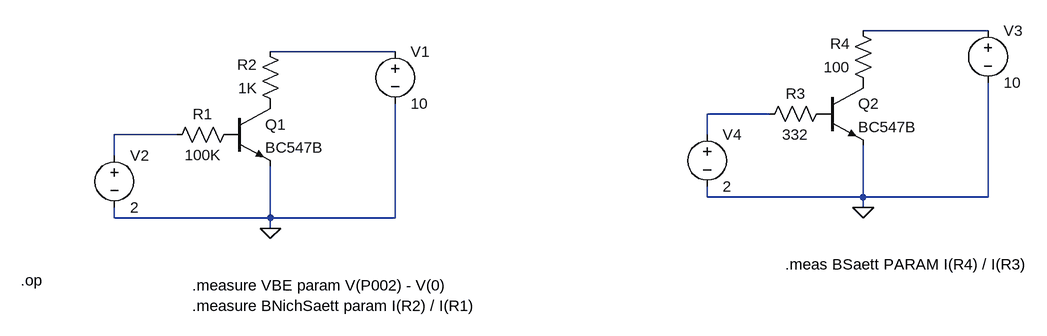
[diagram p0: schematic Schaltverstärker_Transistor_Simulation.asc]
Schaltverstärker_Transistor_Simulation.asc, the LTspice schematic file:
Version 4
SHEET 1 1420 680
WIRE 1248 -144 1056 -144
WIRE 336 -112 144 -112
WIRE 912 -16 816 -16
WIRE 0 16 -96 16
WIRE 816 16 816 -16
WIRE -96 48 -96 16
WIRE 816 112 816 96
WIRE 1056 112 1056 32
WIRE 1056 112 816 112
WIRE 1248 112 1248 -64
WIRE 1248 112 1056 112
WIRE 1056 128 1056 112
WIRE -96 144 -96 128
WIRE 144 144 144 64
WIRE 144 144 -96 144
WIRE 336 144 336 -32
WIRE 336 144 144 144
WIRE 144 160 144 144
FLAG 144 160 0
FLAG 1056 128 0
SYMBOL npn 80 -32 R0
SYMATTR InstName Q1
SYMATTR Value BC547B
SYMBOL res 96 0 R90
WINDOW 0 0 56 VBottom 2
WINDOW 3 32 56 VTop 2
SYMATTR InstName R1
SYMATTR Value 100K
SYMATTR SpiceLine tol=1 pwr=0.1
SYMBOL voltage 336 -128 R0
WINDOW 123 0 0 Left 0
WINDOW 39 0 0 Left 0
SYMATTR InstName V1
SYMATTR Value 10
SYMBOL res 160 -16 R180
WINDOW 0 36 76 Left 2
WINDOW 3 36 40 Left 2
SYMATTR InstName R2
SYMATTR Value 1K
SYMATTR SpiceLine tol=1 pwr=0.1
SYMBOL voltage -96 32 R0
WINDOW 123 0 0 Left 0
WINDOW 39 0 0 Left 0
SYMATTR InstName V2
SYMATTR Value 2
SYMBOL npn 992 -64 R0
SYMATTR InstName Q2
SYMATTR Value BC547B
SYMBOL res 1008 -32 R90
WINDOW 0 0 56 VBottom 2
WINDOW 3 32 56 VTop 2
SYMATTR InstName R3
SYMATTR Value 332
SYMATTR SpiceLine tol=1 pwr=0.1
SYMBOL voltage 1248 -160 R0
WINDOW 123 0 0 Left 0
WINDOW 39 0 0 Left 0
SYMATTR InstName V3
SYMATTR Value 10
SYMBOL res 1072 -48 R180
WINDOW 0 36 76 Left 2
WINDOW 3 36 40 Left 2
SYMATTR InstName R4
SYMATTR Value 100
SYMATTR SpiceLine tol=1 pwr=0.1
SYMBOL voltage 816 0 R0
WINDOW 123 0 0 Left 0
WINDOW 39 0 0 Left 0
SYMATTR InstName V4
SYMATTR Value 2
TEXT -240 240 Left 2 !.op
TEXT 24 248 Left 2 !.measure VBE param V(P002) - V(0)\n.measure BNichSaett param I(R2) / I(R1)
TEXT 936 216 Left 2 !.meas BSaett PARAM I(R4) / I(R3)

The netlist it stands for:
* Schaltverstärker_Transistor_Simulation.asc
Q1 P001 P002 0 0 BC547B
R1 P002 N004 100K tol=1 pwr=0.1
V1 N002 0 10
R2 P001 N002 1K tol=1 pwr=0.1
V2 N004 0 2
Q2 P003 P004 0 0 BC547B
R3 P004 N003 332 tol=1 pwr=0.1
V3 N001 0 10
R4 P003 N001 100 tol=1 pwr=0.1
V4 N003 0 2
.model NPN NPN
.model PNP PNP
.lib standard.bjt
.op
.measure VBE param V(P002) - V(0)
.measure BNichSaett param I(R2) / I(R1)
.meas BSaett PARAM I(R4) / I(R3)
.backanno
.end